# EAGLE schematic power_amp4 (EAGLE 6.5.0)
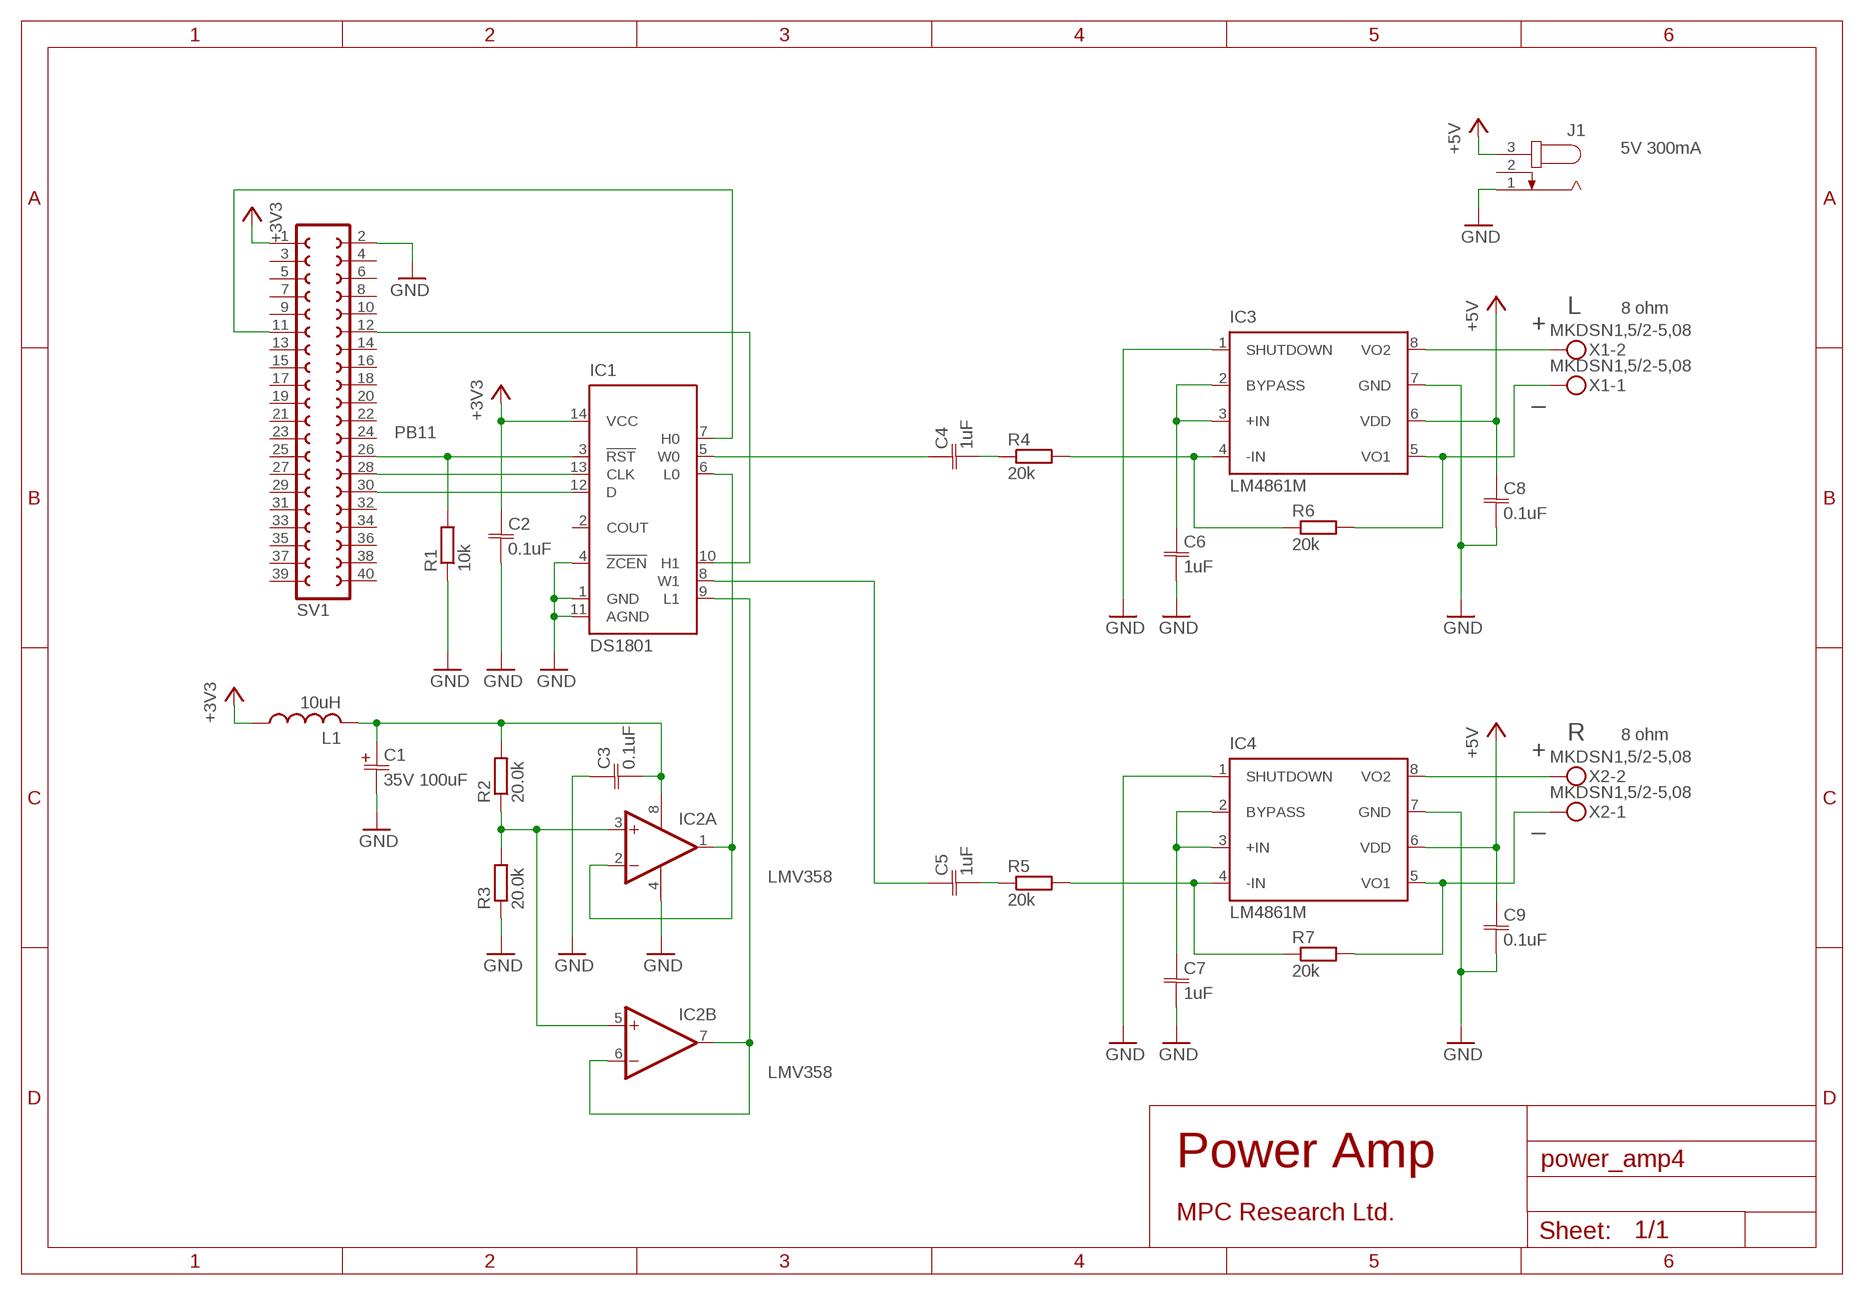
[diagram p0: schematic, sheet 1]

## Parts
C1  35V 100uF  CPOL-JIS  [E2,5-5]
C2  0.1uF  C-JIS050-024X044  [C050-024X044]
C3  0.1uF  C-JIS050-024X044  [C050-024X044]
C4  1uF  C-JIS050-024X044  [C050-024X044]
C5  1uF  C-JIS050-024X044  [C050-024X044]
C6  1uF  C-JIS050-024X044  [C050-024X044]
C7  1uF  C-JIS050-024X044  [C050-024X044]
C8  0.1uF  C-JIS050-024X044  [C050-024X044]
C9  0.1uF  C-JIS050-024X044  [C050-024X044]
IC1  DS1801  [DIL14]
IC2  LMV358  LMV358M  [SO08]
IC3  LM4861M  [SO-08]
IC4  LM4861M  [SO-08]
J1  JACK-PLUG0  [SPC4077]
L1  10uH  L-US0207/10  [0207/10]
R1  10k  R-EU_0207/10  [0207/10]
R2  20.0k  R-EU_0207/10  [0207/10]
R3  20.0k  R-EU_0207/10  [0207/10]
R4  20k  R-EU_0207/10  [0207/10]
R5  20k  R-EU_0207/10  [0207/10]
R6  20k  R-EU_0207/10  [0207/10]
R7  20k  R-EU_0207/10  [0207/10]
SV1  FE20-2  [FE20-2]
X1  MKDSN1,5/2-5,08  [MKDSN1,5/2-5,08]
X2  MKDSN1,5/2-5,08  [MKDSN1,5/2-5,08]

## Nets
+3V3: C2.1 IC1.14(VCC) L1.1 SV1.1
+5V: C8.1 C9.1 IC3.6(VDD) IC4.6(VDD) J1.3
GND: C1.- C2.2 C3.1 C6.2 C7.2 C8.2 C9.2 IC1.1(GND) IC1.4(!ZCEN) IC1.11(AGND) IC2.4(P:V-) IC3.1(SHUTDOWN) IC3.7(GND) IC4.1(SHUTDOWN) IC4.7(GND) J1.1 R1.1 R3.1 SV1.2
N$1: IC1.13(CLK) SV1.28
N$2: IC1.12(D) SV1.30
N$3: IC1.3(!RST) R1.2 SV1.26
N$4: C1.+ C3.2 IC2.8(P:V+) L1.2 R2.2
N$5: IC1.7(H0) SV1.11
N$6: IC1.10(H1) SV1.12
N$7: IC1.6(L0) IC2.1(A:OUT) IC2.2(A:-IN)
N$8: C4.2 R4.1
N$9: C5.2 R5.1
N$10: IC3.4(-IN) R4.2 R6.1
N$11: IC3.5(VO1) R6.2 X1.1
N$12: IC1.9(L1) IC2.6(B:-IN) IC2.7(B:OUT)
N$13: IC2.3(A:+IN) IC2.5(B:+IN) R2.1 R3.2
N$14: IC3.8(VO2) X1.2
N$15: C6.1 IC3.2(BYPASS) IC3.3(+IN)
N$16: IC4.4(-IN) R5.2 R7.1
N$17: IC4.5(VO1) R7.2 X2.1
N$18: IC4.8(VO2) X2.2
N$19: C7.1 IC4.2(BYPASS) IC4.3(+IN)
N$22: C4.1 IC1.5(W0)
N$29: C5.1 IC1.8(W1)
Unconnected: IC1.2(COUT) J1.2 SV1.3 SV1.4 SV1.5 SV1.6 SV1.7 SV1.8 SV1.9 SV1.10 SV1.13 SV1.14 SV1.15 SV1.16 SV1.17 SV1.18 SV1.19 SV1.20 SV1.21 SV1.22 SV1.23 SV1.24 SV1.25 SV1.27 SV1.29 SV1.31 SV1.32 SV1.33 SV1.34 SV1.35 SV1.36 SV1.37 SV1.38 SV1.39 SV1.40

## Notes on the sheet
- 5V 300mA
- L | 8 ohm
- +
- _
- PB11
- R | 8 ohm
- +
- _
- Power Amp
- MPC Research Ltd.

## Library data of the parts
C1 = cap:CPOL-JIS: POLARIZED CAPACITOR, Japanese symbol
C2-C9 = cap:C-JIS: CAPACITOR, Japanese symbol
IC1 = maxim:DS1801: Dual Audio Taper Potentiometer
IC2 = linear:LMV358?*: Dual General Purpose, Low Voltage, Rail-to-Rail Output Operational Amplifiers Source: http://www.national.com/mpf/LM/LMV321.html http://www.national.com/dt/lmv_qual.pdf
IC3 IC4 = ti:LM4861M: 1.1W Audio Power Amplifier with Shutdown Mode
J1 = con-jack:JACK-PLUG: DC POWER JACK Power Jack, DC, Right Angle, Through Hole, Rated 5A at 16VDC, PC Terminals Distributor: Farnell (www.Farnell.de) Drawing: 84N1161.pdf / 84N1162.pdf Manufacturer: SPC Technology (www.spctechnology.com) Type: SPC4077 / SPC 4078; OC_FARNELL: unknown; OC_NEWARK: unknown
L1 = resistor:L-US: INDUCTOR, American symbol
R1-R7 = resistor:R-EU_: RESISTOR, European symbol
SV1 = con-lsta:FE20-2: FEMALE HEADER; OC_FARNELL: unknown; OC_NEWARK: unknown
X1 X2 = con-phoenix-508:MKDSN1,5/2-5,08: MKDSN 1,5/ 2-5,08 Printklemme Nennstrom: 13,5 A Nennspannung: 250 V Rastermaß: 5,08 mm Polzahl: 2 Anschlussart: Schraubanschluss Montage: Löten Anschlussrichtung Leiter/Platine: 0 ° Artikelnummer: 1729128 Source: http://eshop.phoenixcontact.com .. 1729128.pdf; MPN: MKDSN 1,5/2-5.08; OC_FARNELL: 1792903; OC_NEWARK: 30M2397